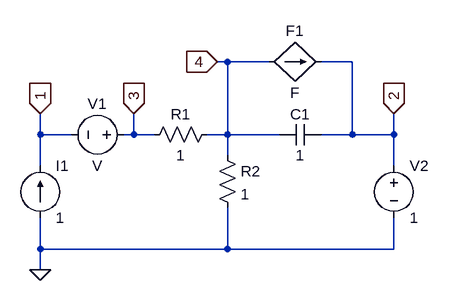
[diagram p0: schematic Two port circuit3.asc]
Two port circuit3.asc, the LTspice schematic file:
Version 4
SHEET 1 880 680
WIRE 256 -32 240 -32
WIRE 320 -32 256 -32
WIRE 448 -32 400 -32
WIRE -32 80 -32 48
WIRE 16 80 -32 80
WIRE 112 80 112 48
WIRE 112 80 96 80
WIRE 144 80 112 80
WIRE 256 80 256 -32
WIRE 256 80 224 80
WIRE 336 80 256 80
WIRE 448 80 448 -32
WIRE 448 80 400 80
WIRE 512 80 512 48
WIRE 512 80 448 80
WIRE 256 112 256 80
WIRE -32 128 -32 80
WIRE 512 128 512 80
WIRE -32 256 -32 208
WIRE 256 256 256 192
WIRE 256 256 -32 256
WIRE 512 256 512 208
WIRE 512 256 256 256
WIRE -32 288 -32 256
FLAG -32 288 0
FLAG -32 48 1
IOPIN -32 48 In
FLAG 112 48 3
IOPIN 112 48 In
FLAG 512 48 2
IOPIN 512 48 In
FLAG 240 -32 4
IOPIN 240 -32 In
SYMBOL voltage 512 112 R0
WINDOW 123 0 0 Left 2
WINDOW 39 0 0 Left 2
SYMATTR InstName V2
SYMATTR Value 1
SYMBOL res 128 96 R270
WINDOW 0 32 56 VTop 2
WINDOW 3 0 56 VBottom 2
SYMATTR InstName R1
SYMATTR Value 1
SYMBOL current -32 208 M180
WINDOW 0 24 80 Left 2
WINDOW 3 24 0 Left 2
WINDOW 123 0 0 Left 2
WINDOW 39 0 0 Left 2
SYMATTR InstName I1
SYMATTR Value 1
SYMBOL res 240 96 R0
SYMATTR InstName R2
SYMATTR Value 1
SYMBOL cap 336 96 R270
WINDOW 0 32 32 VTop 2
WINDOW 3 0 32 VBottom 2
SYMATTR InstName C1
SYMATTR Value 1
SYMBOL f 320 -32 R270
WINDOW 0 32 40 VTop 2
WINDOW 3 -32 40 VBottom 2
SYMATTR InstName F1
SYMBOL voltage 112 80 R90
WINDOW 0 -32 56 VBottom 2
WINDOW 3 32 56 VTop 2
SYMATTR InstName V1

The netlist it stands for:
* Two port circuit3.asc
V2 2 0 1
R1 3 4 1
I1 0 1 1
R2 4 0 1
C1 4 2 1
F1 4 2 F
V1 3 1 V
.backanno
.end